# EAGLE schematic MCDB (EAGLE 9.4.2)

## Sheet 1 of 4
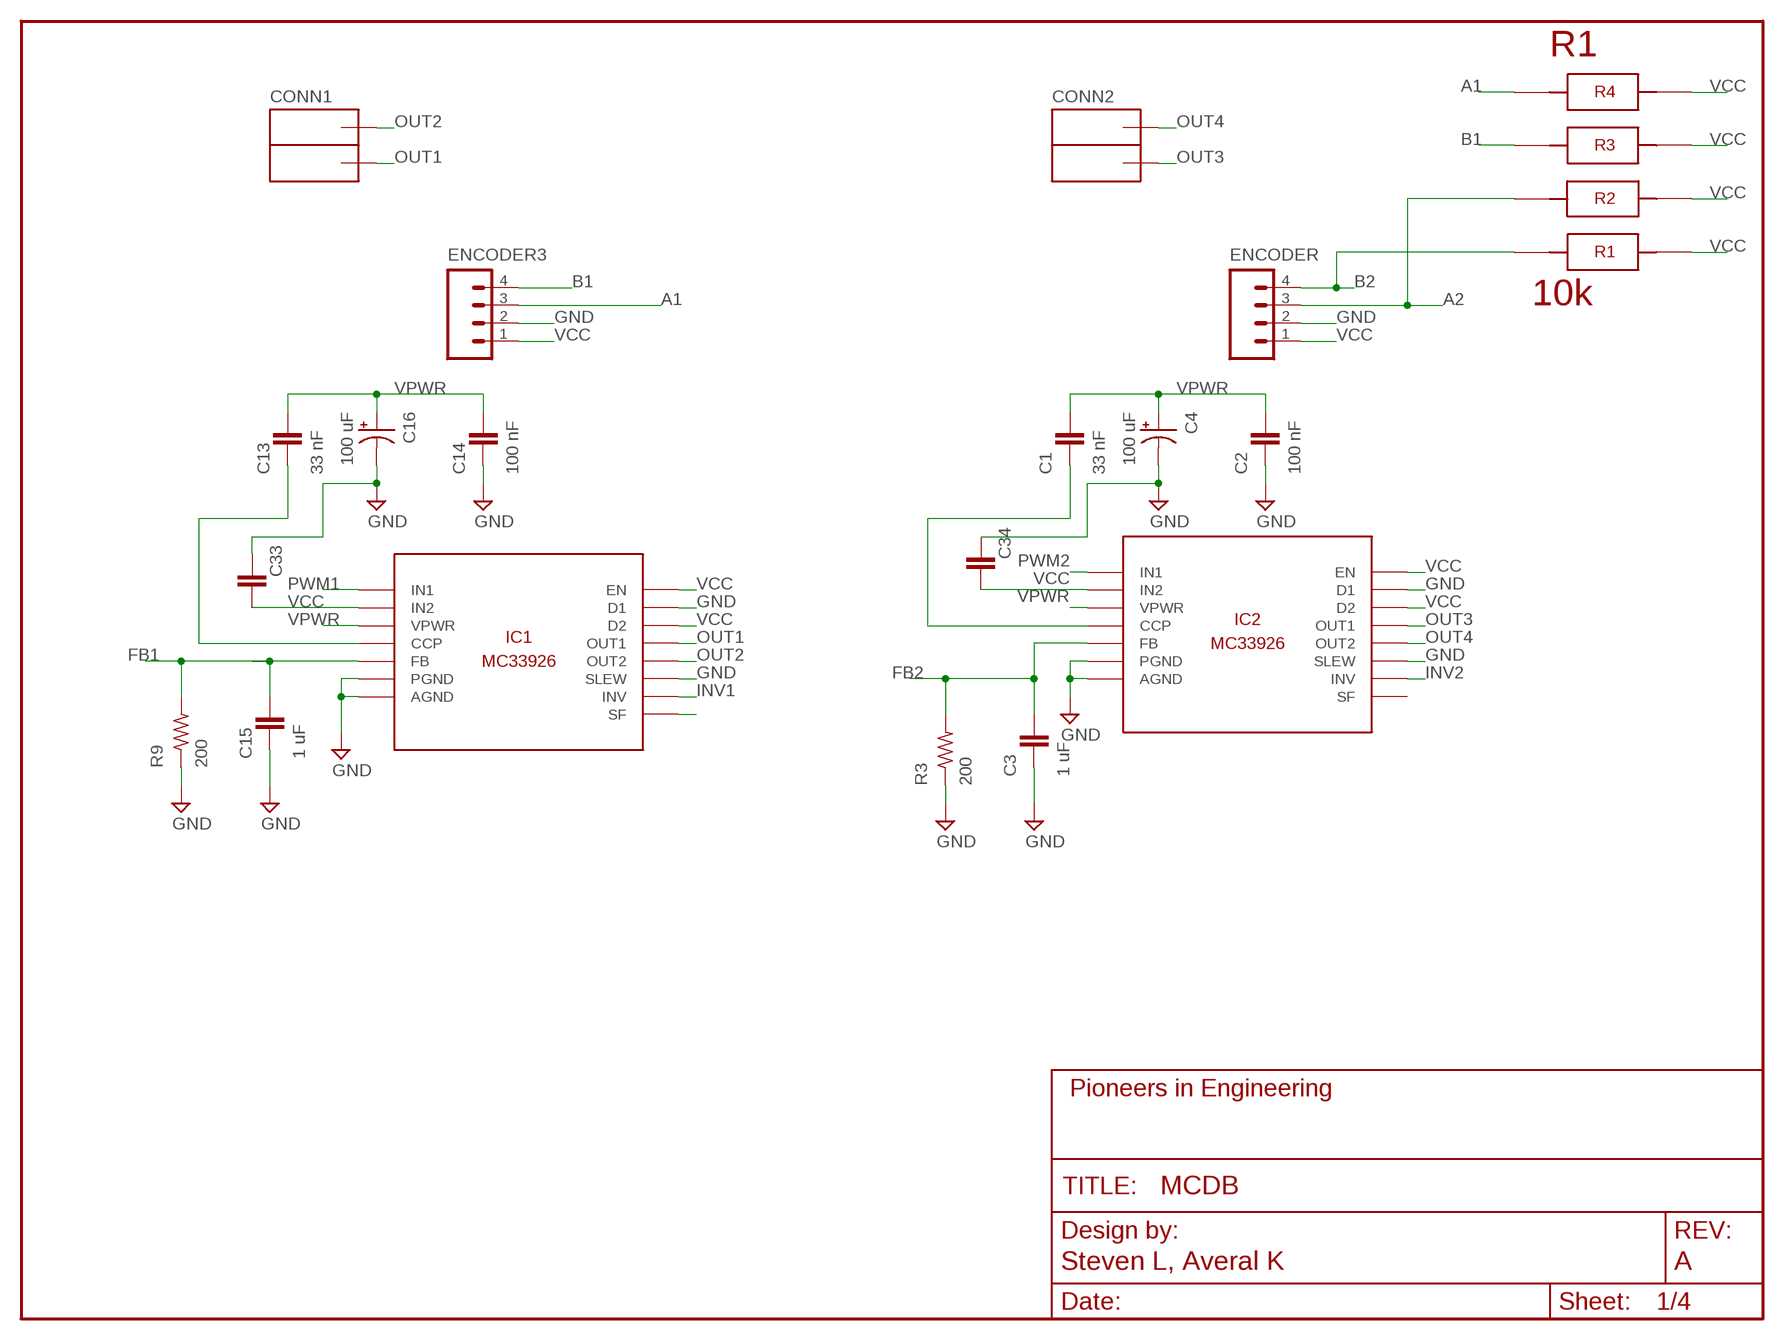
[diagram p0: schematic, sheet 1]
FRAME1 (FRAME_SCHEMATIC): AUTHOR: Steven L, Averal K; REVISION: A

### Parts
C1  33 nF  CAP0603-CAP  [0603-CAP]
C2  100 nF  CAP0603-CAP  [0603-CAP]
C3  1 uF  CAP0603-CAP  [0603-CAP]
C4  100 uF  CAP_POLRADIAL  [.248"CAP_THRU]
C13  33 nF  CAP0603-CAP  [0603-CAP]
C14  100 nF  CAP0603-CAP  [0603-CAP]
C15  1 uF  CAP0603-CAP  [0603-CAP]
C16  100 uF  CAP_POLRADIAL  [.248"CAP_THRU]
C33  CAP0603-CAP  [0603-CAP]
C34  CAP0603-CAP  [0603-CAP]
CONN1  ANDERSONVERTICAL  [ANDERSON_VERTICAL]
CONN2  ANDERSONVERTICAL  [ANDERSON_VERTICAL]
ENCODER  M041X04-MTA  [1X04-MTA]
ENCODER3  M041X04-MTA  [1X04-MTA]
IC1  MC33926  [PQFN-32]
IC2  MC33926  [PQFN-32]
R1  10k  4X-0603  [4X-0603]
R3  200  R-US_R0603  [R0603]
R9  200  R-US_R0603  [R0603]

### Nets
A1: ENCODER3.3 R1.5 ; also sheet 4
A2: ENCODER.3 R1.7 ; also sheet 4
B1: ENCODER3.4 R1.6 ; also sheet 4
B2: ENCODER.4 R1.8 ; also sheet 4
CCP: C13.1 IC1.32(CCP)
CCP2: C1.1 IC2.32(CCP)
FB1: C15.2 IC1.8(FB) R9.2
FB2: C3.2 IC2.8(FB) R3.2
GND: C2.1 C3.1 C4.MINUS(-) C14.1 C15.1 C16.MINUS(-) C33.1 C34.1 ENCODER3.2 ENCODER.2 IC1.3(SLEW) IC1.5(AGND) IC1.18(PGND) IC1.19(PGND) IC1.20(PGND) IC1.22(PGND) IC1.23(PGND) IC1.24(PGND) IC1.26(D1) IC1.MID(AGND) IC2.3(SLEW) IC2.5(AGND) IC2.18(PGND) IC2.19(PGND) IC2.20(PGND) IC2.22(PGND) IC2.23(PGND) IC2.24(PGND) IC2.26(D1) IC2.MID(AGND) R3.1 R9.1 ; also sheet 2,3,4
INV1: IC1.7(INV) ; also sheet 4
INV2: IC2.7(INV) ; also sheet 4
N$11: IC1.21(SF)
OUT1: CONN1.PIN1(OUTB) IC1.12(OUT1) IC1.13(OUT1) IC1.14(OUT1) IC1.15(OUT1)
OUT2: CONN1.PIN2(OUTA) IC1.27(OUT2) IC1.28(OUT2) IC1.29(OUT2) IC1.30(OUT2)
OUT3: CONN2.PIN1(OUTB) IC2.12(OUT1) IC2.13(OUT1) IC2.14(OUT1) IC2.15(OUT1)
OUT4: CONN2.PIN2(OUTA) IC2.27(OUT2) IC2.28(OUT2) IC2.29(OUT2) IC2.30(OUT2)
PWM1: IC1.2(IN1) ; also sheet 4
PWM2: IC2.2(IN1) ; also sheet 4
VCC: C33.2 C34.2 ENCODER3.1 ENCODER.1 IC1.1(IN2) IC1.10(EN) IC1.16(D2) IC2.1(IN2) IC2.10(EN) IC2.16(D2) R1.1 R1.2 R1.3 R1.4 ; also sheet 2,3,4
VPWR: C1.2 C2.2 C4.PLUS(+) C13.2 C14.2 C16.PLUS(+) IC1.4(VPWR) IC1.6(VPWR) IC1.11(VPWR) IC1.31(VPWR) IC2.4(VPWR) IC2.6(VPWR) IC2.11(VPWR) IC2.31(VPWR) ; also sheet 2,3,4
Unconnected: IC2.21(SF)

## Sheet 2 of 4
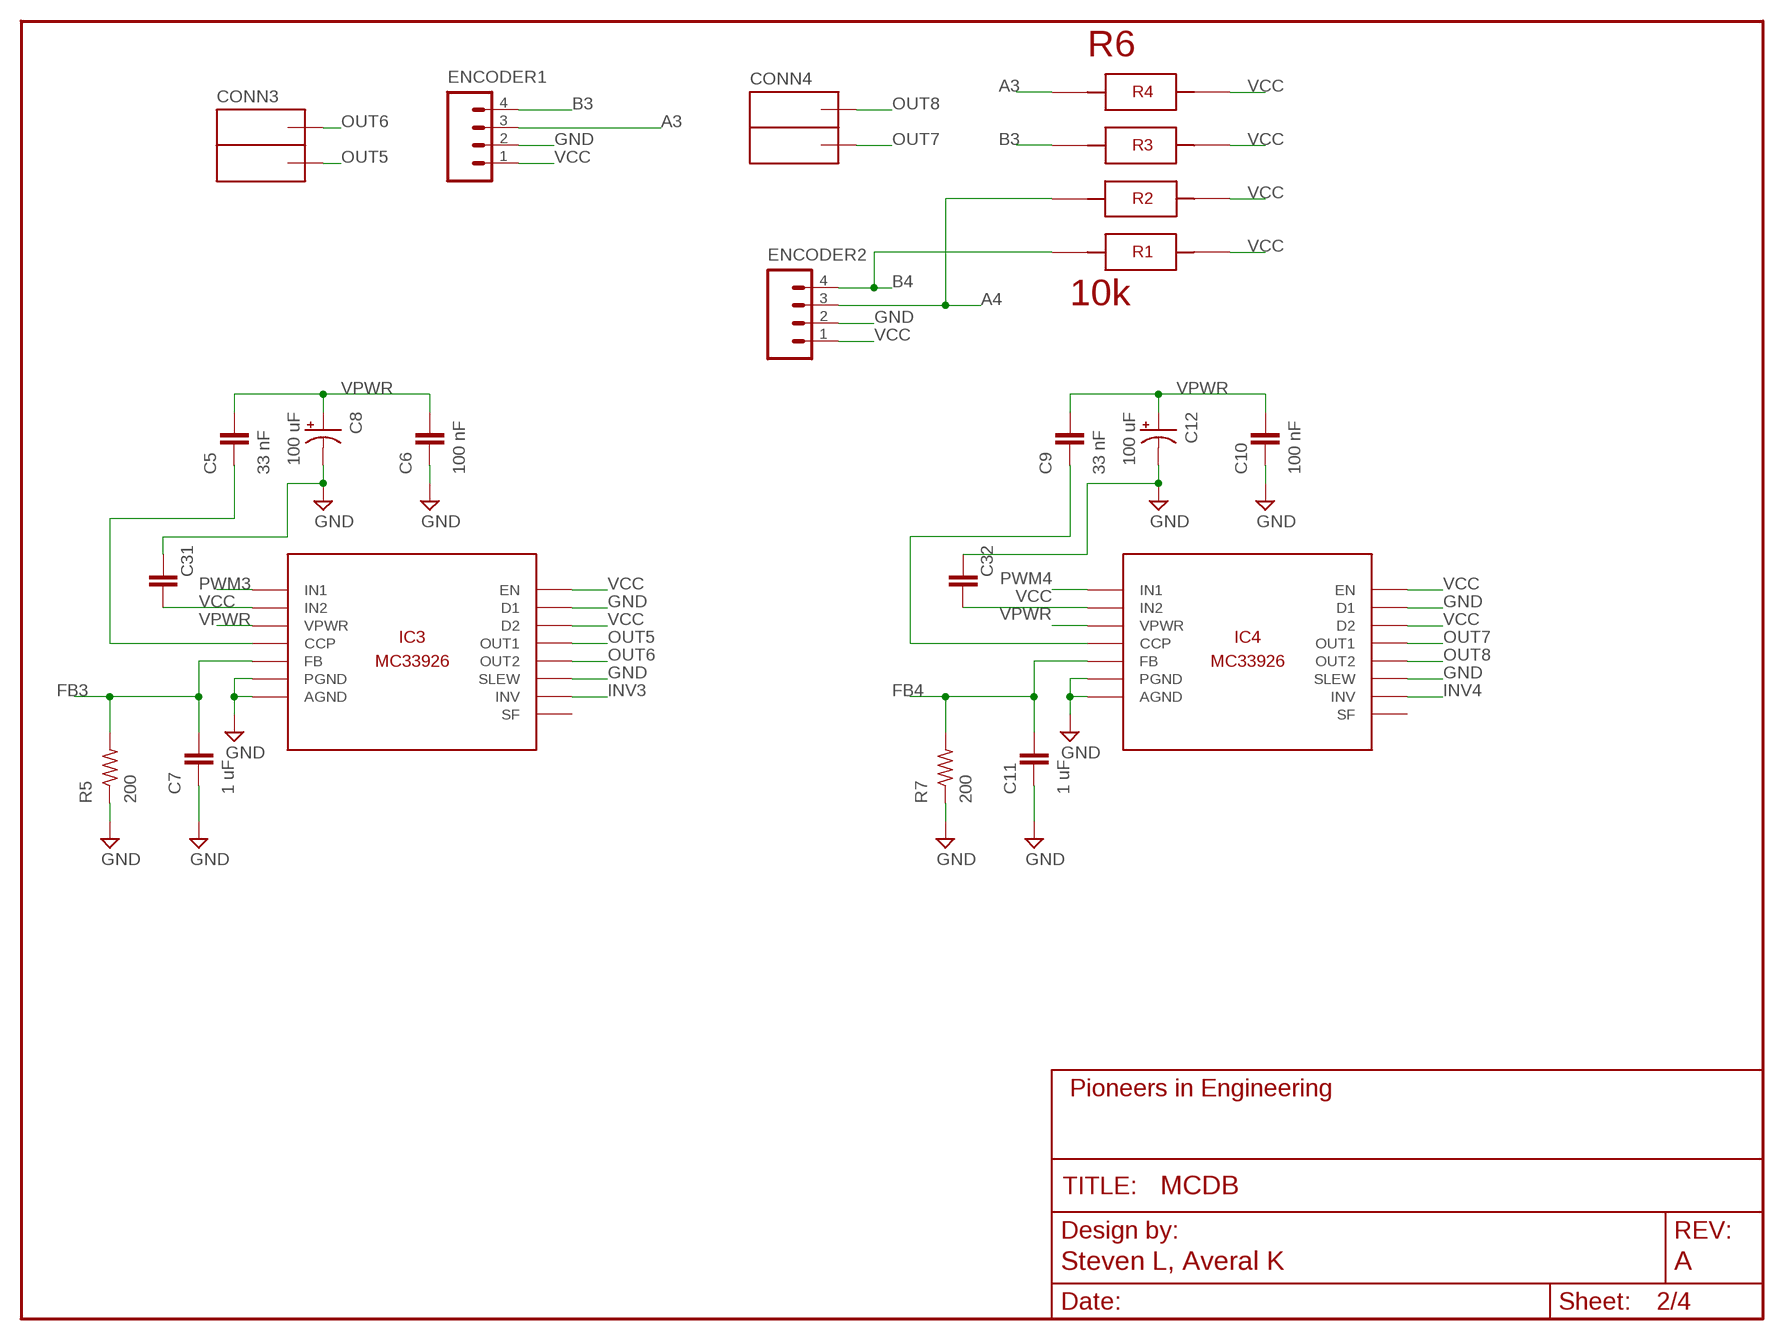
[diagram p1: schematic, sheet 2]
FRAME2 (FRAME_SCHEMATIC): AUTHOR: Steven L, Averal K; REVISION: A

### Parts
C5  33 nF  CAP0603-CAP  [0603-CAP]
C6  100 nF  CAP0603-CAP  [0603-CAP]
C7  1 uF  CAP0603-CAP  [0603-CAP]
C8  100 uF  CAP_POLRADIAL  [.248"CAP_THRU]
C9  33 nF  CAP0603-CAP  [0603-CAP]
C10  100 nF  CAP0603-CAP  [0603-CAP]
C11  1 uF  CAP0603-CAP  [0603-CAP]
C12  100 uF  CAP_POLRADIAL  [.248"CAP_THRU]
C31  CAP0603-CAP  [0603-CAP]
C32  CAP0603-CAP  [0603-CAP]
CONN3  ANDERSONVERTICAL  [ANDERSON_VERTICAL]
CONN4  ANDERSONVERTICAL  [ANDERSON_VERTICAL]
ENCODER1  M041X04-MTA  [1X04-MTA]
ENCODER2  M041X04-MTA  [1X04-MTA]
IC3  MC33926  [PQFN-32]
IC4  MC33926  [PQFN-32]
R5  200  R-US_R0603  [R0603]
R6  10k  4X-0603  [4X-0603]
R7  200  R-US_R0603  [R0603]

### Nets
A3: ENCODER1.3 R6.5 ; also sheet 4
A4: ENCODER2.3 R6.7 ; also sheet 4
B3: ENCODER1.4 R6.6 ; also sheet 4
B4: ENCODER2.4 R6.8 ; also sheet 4
CCP3: C5.1 IC3.32(CCP)
CCP4: C9.1 IC4.32(CCP)
FB3: C7.2 IC3.8(FB) R5.2
FB4: C11.2 IC4.8(FB) R7.2
GND: C6.1 C7.1 C8.MINUS(-) C10.1 C11.1 C12.MINUS(-) C31.1 C32.1 ENCODER1.2 ENCODER2.2 IC3.3(SLEW) IC3.5(AGND) IC3.18(PGND) IC3.19(PGND) IC3.20(PGND) IC3.22(PGND) IC3.23(PGND) IC3.24(PGND) IC3.26(D1) IC3.MID(AGND) IC4.3(SLEW) IC4.5(AGND) IC4.18(PGND) IC4.19(PGND) IC4.20(PGND) IC4.22(PGND) IC4.23(PGND) IC4.24(PGND) IC4.26(D1) IC4.MID(AGND) R5.1 R7.1 ; also sheet 1,3,4
INV3: IC3.7(INV) ; also sheet 4
INV4: IC4.7(INV) ; also sheet 4
OUT5: CONN3.PIN1(OUTB) IC3.12(OUT1) IC3.13(OUT1) IC3.14(OUT1) IC3.15(OUT1)
OUT6: CONN3.PIN2(OUTA) IC3.27(OUT2) IC3.28(OUT2) IC3.29(OUT2) IC3.30(OUT2)
OUT7: CONN4.PIN1(OUTB) IC4.12(OUT1) IC4.13(OUT1) IC4.14(OUT1) IC4.15(OUT1)
OUT8: CONN4.PIN2(OUTA) IC4.27(OUT2) IC4.28(OUT2) IC4.29(OUT2) IC4.30(OUT2)
PWM3: IC3.2(IN1) ; also sheet 4
PWM4: IC4.2(IN1) ; also sheet 4
VCC: C31.2 C32.2 ENCODER1.1 ENCODER2.1 IC3.1(IN2) IC3.10(EN) IC3.16(D2) IC4.1(IN2) IC4.10(EN) IC4.16(D2) R6.1 R6.2 R6.3 R6.4 ; also sheet 1,3,4
VPWR: C5.2 C6.2 C8.PLUS(+) C9.2 C10.2 C12.PLUS(+) IC3.4(VPWR) IC3.6(VPWR) IC3.11(VPWR) IC3.31(VPWR) IC4.4(VPWR) IC4.6(VPWR) IC4.11(VPWR) IC4.31(VPWR) ; also sheet 1,3,4
Unconnected: IC3.21(SF) IC4.21(SF)

## Sheet 3 of 4
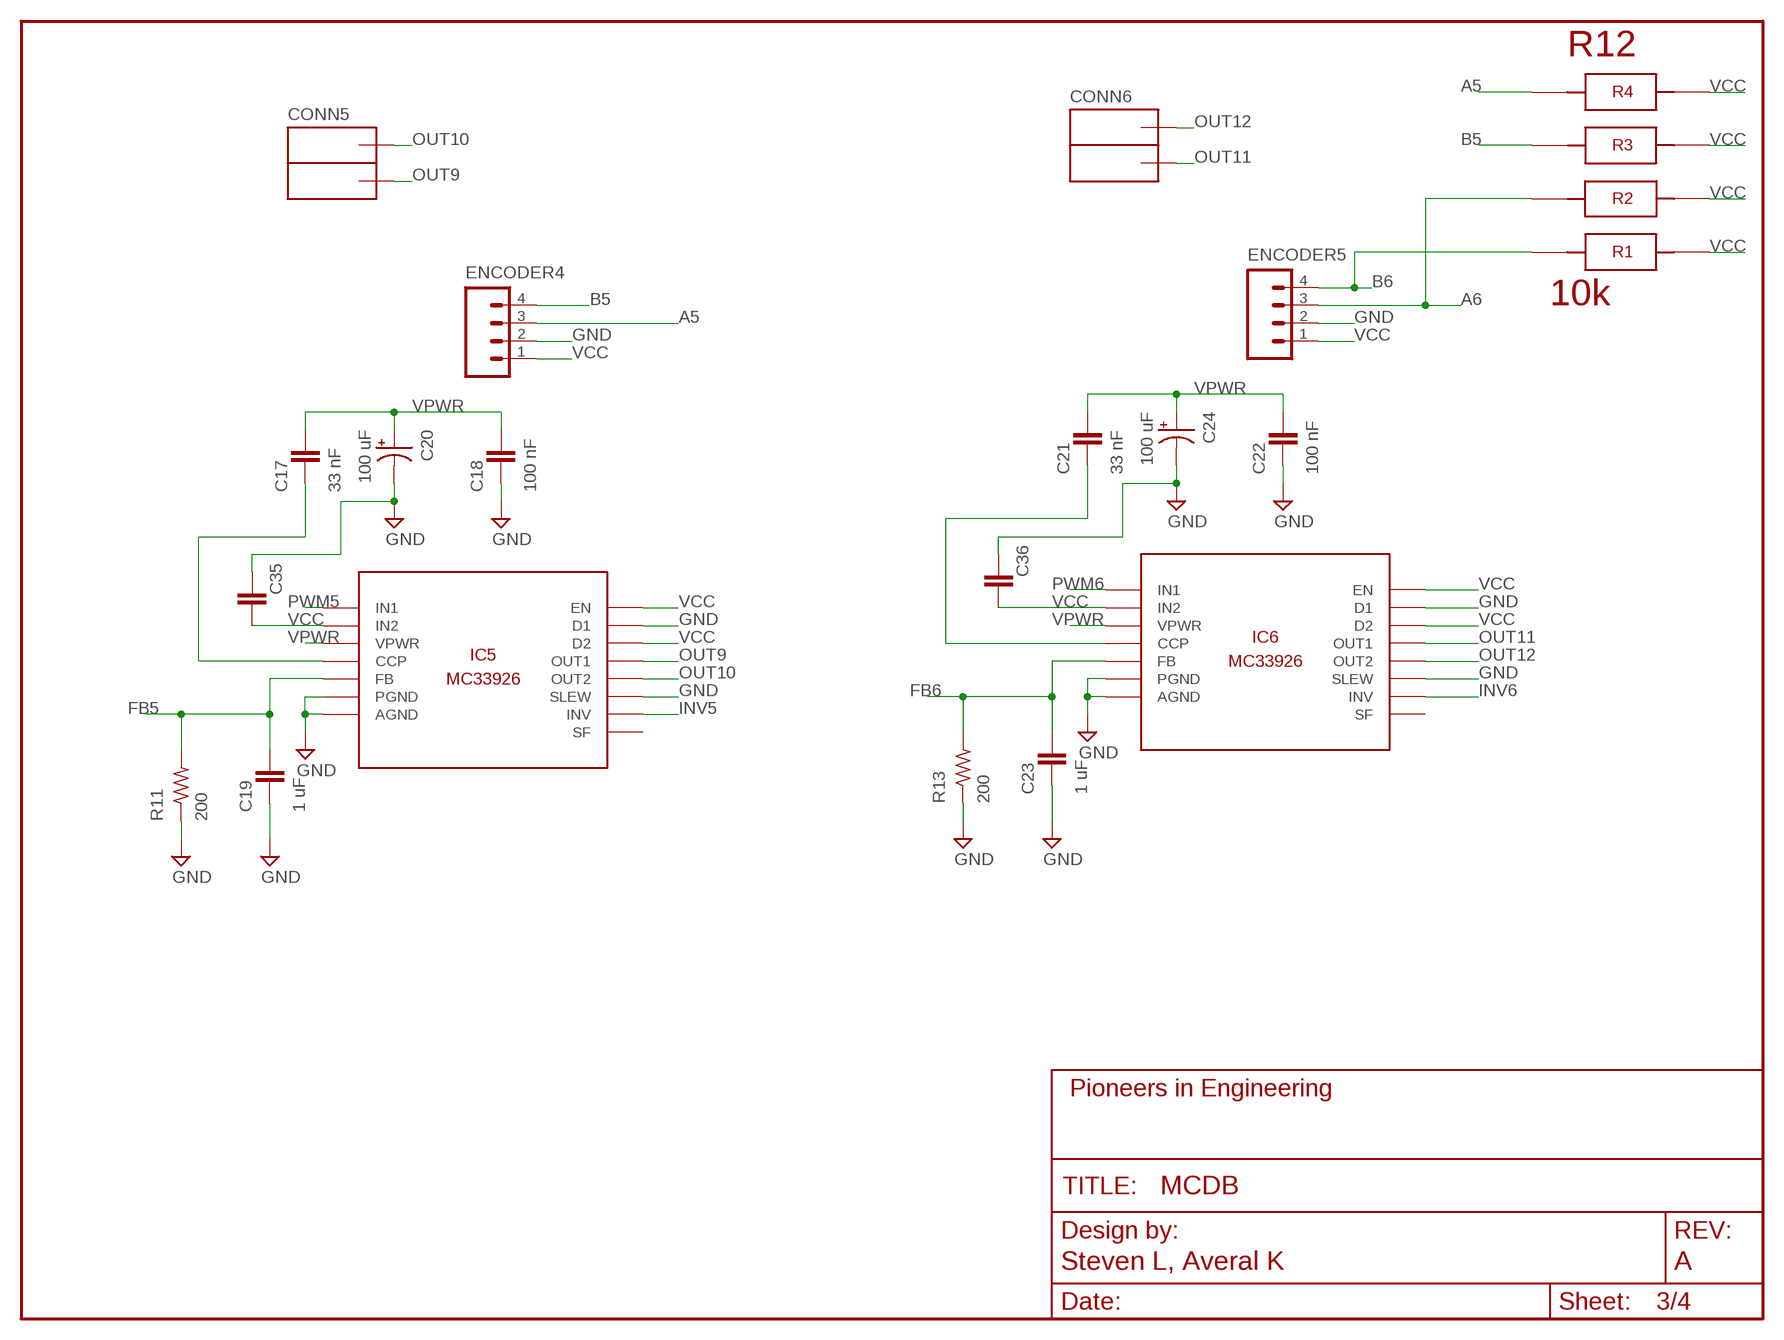
[diagram p2: schematic, sheet 3]
FRAME3 (FRAME_SCHEMATIC): AUTHOR: Steven L, Averal K; REVISION: A

### Parts
C17  33 nF  CAP0603-CAP  [0603-CAP]
C18  100 nF  CAP0603-CAP  [0603-CAP]
C19  1 uF  CAP0603-CAP  [0603-CAP]
C20  100 uF  CAP_POLRADIAL  [.248"CAP_THRU]
C21  33 nF  CAP0603-CAP  [0603-CAP]
C22  100 nF  CAP0603-CAP  [0603-CAP]
C23  1 uF  CAP0603-CAP  [0603-CAP]
C24  100 uF  CAP_POLRADIAL  [.248"CAP_THRU]
C35  CAP0603-CAP  [0603-CAP]
C36  CAP0603-CAP  [0603-CAP]
CONN5  ANDERSONVERTICAL  [ANDERSON_VERTICAL]
CONN6  ANDERSONVERTICAL  [ANDERSON_VERTICAL]
ENCODER4  M041X04-MTA  [1X04-MTA]
ENCODER5  M041X04-MTA  [1X04-MTA]
IC5  MC33926  [PQFN-32]
IC6  MC33926  [PQFN-32]
R11  200  R-US_R0603  [R0603]
R12  10k  4X-0603  [4X-0603]
R13  200  R-US_R0603  [R0603]

### Nets
A5: ENCODER4.3 R12.5 ; also sheet 4
A6: ENCODER5.3 R12.7 ; also sheet 4
B5: ENCODER4.4 R12.6 ; also sheet 4
B6: ENCODER5.4 R12.8 ; also sheet 4
CCP5: C17.1 IC5.32(CCP)
CCP6: C21.1 IC6.32(CCP)
FB5: C19.2 IC5.8(FB) R11.2
FB6: C23.2 IC6.8(FB) R13.2
GND: C18.1 C19.1 C20.MINUS(-) C22.1 C23.1 C24.MINUS(-) C35.1 C36.1 ENCODER4.2 ENCODER5.2 IC5.3(SLEW) IC5.5(AGND) IC5.18(PGND) IC5.19(PGND) IC5.20(PGND) IC5.22(PGND) IC5.23(PGND) IC5.24(PGND) IC5.26(D1) IC5.MID(AGND) IC6.3(SLEW) IC6.5(AGND) IC6.18(PGND) IC6.19(PGND) IC6.20(PGND) IC6.22(PGND) IC6.23(PGND) IC6.24(PGND) IC6.26(D1) IC6.MID(AGND) R11.1 R13.1 ; also sheet 1,2,4
INV5: IC5.7(INV) ; also sheet 4
INV6: IC6.7(INV) ; also sheet 4
OUT9: CONN5.PIN1(OUTB) IC5.12(OUT1) IC5.13(OUT1) IC5.14(OUT1) IC5.15(OUT1)
OUT10: CONN5.PIN2(OUTA) IC5.27(OUT2) IC5.28(OUT2) IC5.29(OUT2) IC5.30(OUT2)
OUT11: CONN6.PIN1(OUTB) IC6.12(OUT1) IC6.13(OUT1) IC6.14(OUT1) IC6.15(OUT1)
OUT12: CONN6.PIN2(OUTA) IC6.27(OUT2) IC6.28(OUT2) IC6.29(OUT2) IC6.30(OUT2)
PWM5: IC5.2(IN1) ; also sheet 4
PWM6: IC6.2(IN1) ; also sheet 4
VCC: C35.2 C36.2 ENCODER4.1 ENCODER5.1 IC5.1(IN2) IC5.10(EN) IC5.16(D2) IC6.1(IN2) IC6.10(EN) IC6.16(D2) R12.1 R12.2 R12.3 R12.4 ; also sheet 1,2,4
VPWR: C17.2 C18.2 C20.PLUS(+) C21.2 C22.2 C24.PLUS(+) IC5.4(VPWR) IC5.6(VPWR) IC5.11(VPWR) IC5.31(VPWR) IC6.4(VPWR) IC6.6(VPWR) IC6.11(VPWR) IC6.31(VPWR) ; also sheet 1,2,4
Unconnected: IC5.21(SF) IC6.21(SF)

## Sheet 4 of 4
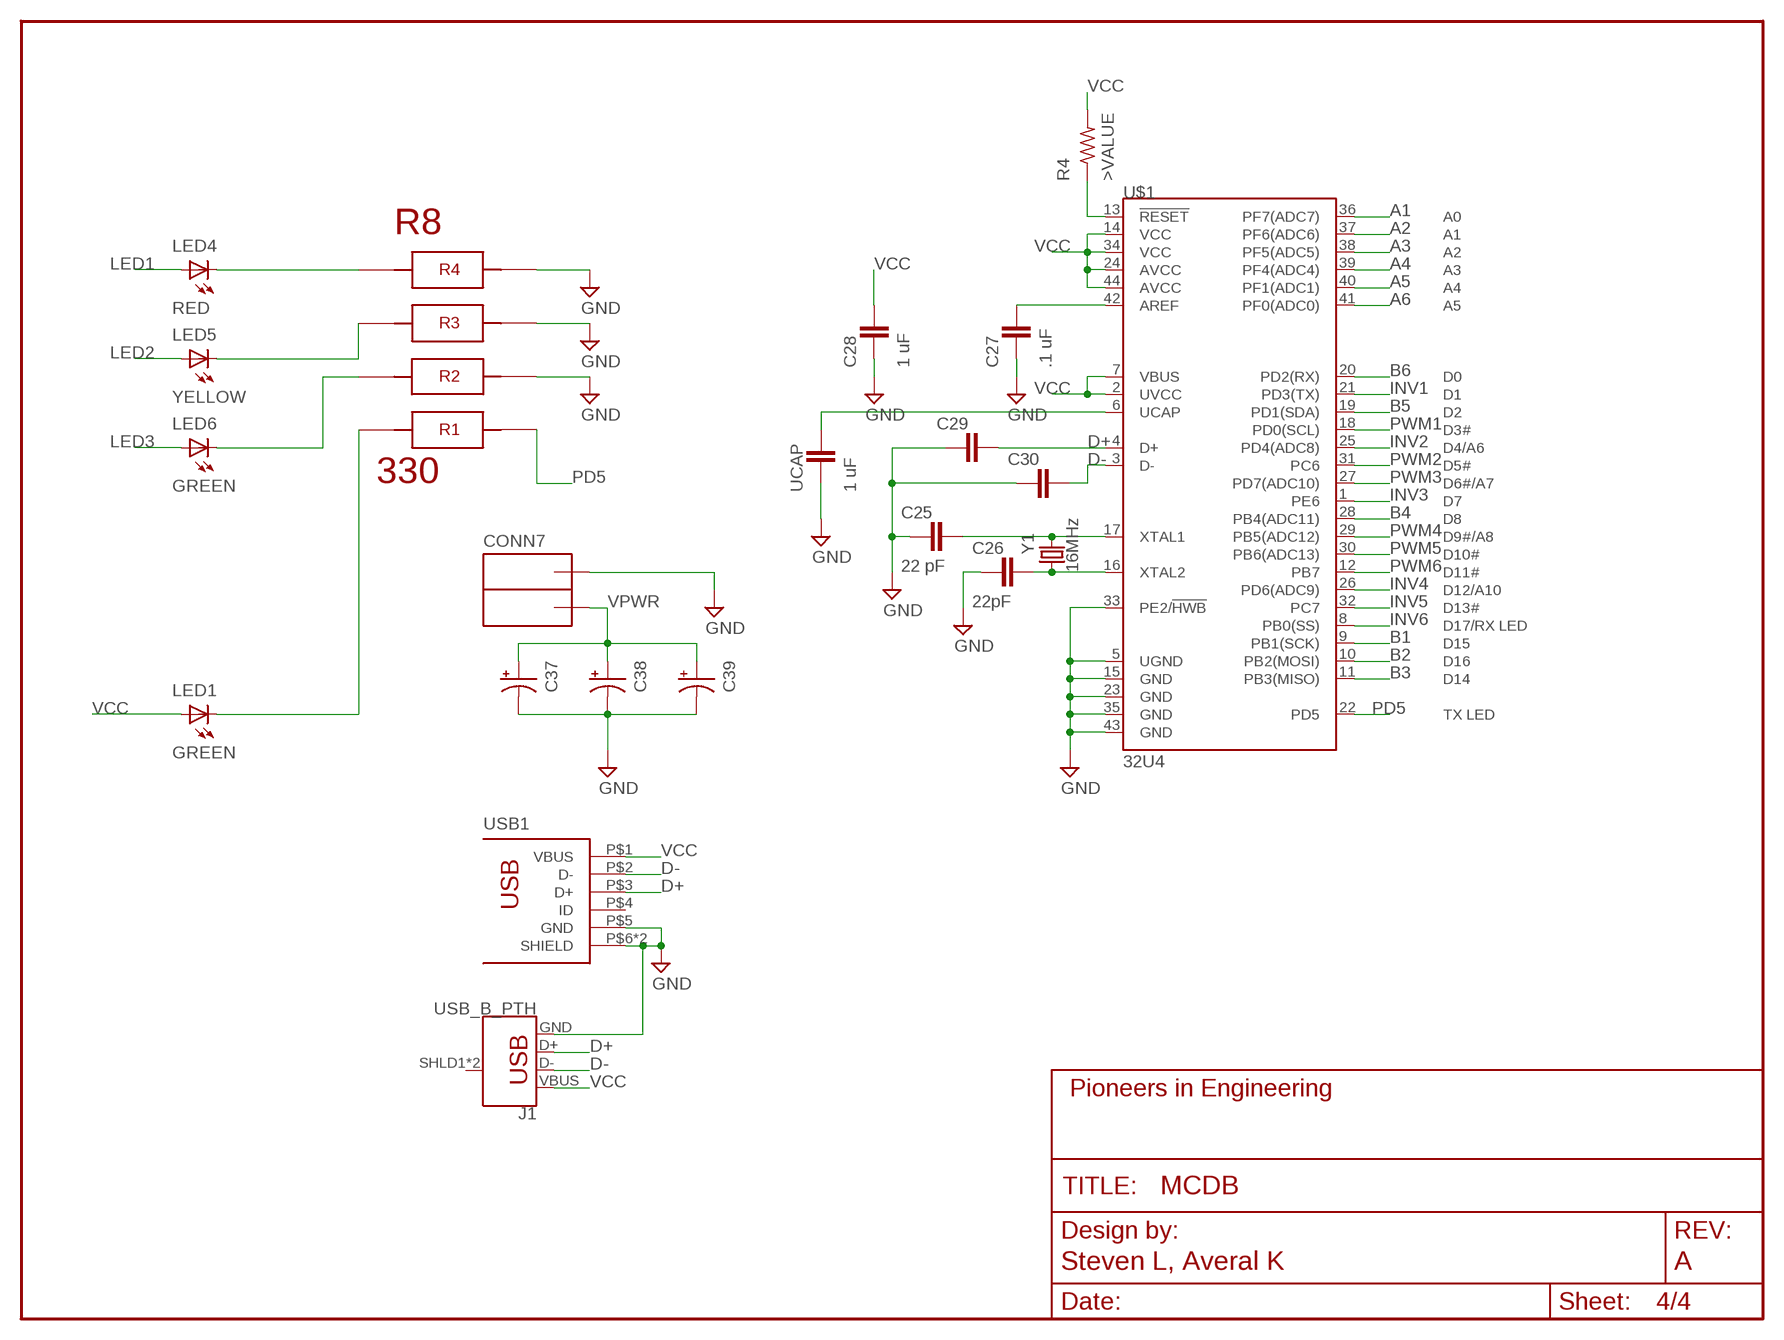
[diagram p3: schematic, sheet 4]
FRAME4 (FRAME_SCHEMATIC): AUTHOR: Steven L, Averal K; REVISION: A

### Parts
C25  22 pF  CAP0603-CAP  [0603-CAP]
C26  22pF  CAP0603-CAP  [0603-CAP]
C27  .1 uF  CAP0603-CAP  [0603-CAP]
C28  1 uF  CAP0603-CAP  [0603-CAP]
C29  CAP0603-CAP  [0603-CAP]
C30  CAP0603-CAP  [0603-CAP]
C37  CAP_POLRADIAL  [.248"CAP_THRU]
C38  CAP_POLRADIAL  [.248"CAP_THRU]
C39  CAP_POLRADIAL  [.248"CAP_THRU]
CONN7  ANDERSONVERTICAL  [ANDERSON_VERTICAL]
J1  USB_B_PTH  [USB-B-PTH]
LED1  GREEN  LED1206  [LED-1206]
LED4  RED  LED1206  [LED-1206]
LED5  YELLOW  LED1206  [LED-1206]
LED6  GREEN  LED1206  [LED-1206]
R4  >VALUE  R-US_R0603  [R0603]
R8  330  4X-0603  [4X-0603]
U$1  32U4  ATMEGA32U4TQFP-44  [TQFP44]
UCAP  1 uF  CAP0603-CAP  [0603-CAP]
USB1  USB-OTGMICRO-AB-VERT  [USB-MICRO-AB-VERT]
Y1  16MHz  CRYSTAL7.6X4.1  [CRYSTAL-SMD-7.6X4.1-2PIN]

### Nets
A1: U$1.36(PF7(ADC7)) ; also sheet 1
A2: U$1.37(PF6(ADC6)) ; also sheet 1
A3: U$1.38(PF5(ADC5)) ; also sheet 2
A4: U$1.39(PF4(ADC4)) ; also sheet 2
A5: U$1.40(PF1(ADC1)) ; also sheet 3
A6: U$1.41(PF0(ADC0)) ; also sheet 3
B1: U$1.9(PB1(SCK)) ; also sheet 1
B2: U$1.10(PB2(MOSI)) ; also sheet 1
B3: U$1.11(PB3(MISO)) ; also sheet 2
B4: U$1.28(PB4(ADC11)) ; also sheet 2
B5: U$1.19(PD1(SDA)) ; also sheet 3
B6: U$1.20(PD2(RX)) ; also sheet 3
D+: C29.2 J1.D+ U$1.4(D+) USB1.P$3(D+)
D-: C30.2 J1.D- U$1.3(D-) USB1.P$2(D-)
GND: C25.1 C26.1 C27.1 C28.1 C29.1 C30.1 C37.MINUS(-) C38.MINUS(-) C39.MINUS(-) CONN7.PIN2(OUTA) J1.GND R8.2 R8.3 R8.4 U$1.5(UGND) U$1.15(GND) U$1.23(GND) U$1.33(PE2/!HWB) U$1.35(GND) U$1.43(GND) UCAP.1 USB1.P$5(GND) USB1.P$6(SHIELD) USB1.P$7(SHIELD) ; also sheet 1,2,3
INV1: U$1.21(PD3(TX)) ; also sheet 1
INV2: U$1.25(PD4(ADC8)) ; also sheet 1
INV3: U$1.1(PE6) ; also sheet 2
INV4: U$1.26(PD6(ADC9)) ; also sheet 2
INV5: U$1.32(PC7) ; also sheet 3
INV6: U$1.8(PB0(SS)) ; also sheet 3
LED1: LED4.A
LED2: LED5.A
LED3: LED6.A
N$4: LED4.C R8.5
N$5: LED6.C R8.7
N$7: LED5.C R8.6
N$12: LED1.C R8.8
N$16: U$1.6(UCAP) UCAP.2
N$17: C25.2 U$1.17(XTAL1) Y1.P$2
N$18: C26.2 U$1.16(XTAL2) Y1.P$1
N$19: C27.2 U$1.42(AREF)
N$21: R4.1 U$1.13(!RESET)
PD5: R8.1 U$1.22(PD5)
PWM1: U$1.18(PD0(SCL)) ; also sheet 1
PWM2: U$1.31(PC6) ; also sheet 1
PWM3: U$1.27(PD7(ADC10)) ; also sheet 2
PWM4: U$1.29(PB5(ADC12)) ; also sheet 2
PWM5: U$1.30(PB6(ADC13)) ; also sheet 3
PWM6: U$1.12(PB7) ; also sheet 3
VCC: C28.2 J1.VBUS LED1.A R4.2 U$1.2(UVCC) U$1.7(VBUS) U$1.14(VCC) U$1.24(AVCC) U$1.34(VCC) U$1.44(AVCC) USB1.P$1(VBUS) ; also sheet 1,2,3
VPWR: C37.PLUS(+) C38.PLUS(+) C39.PLUS(+) CONN7.PIN1(OUTB) ; also sheet 1,2,3
Unconnected: J1.SHLD1(SHIELD) J1.SHLD2(SHIELD) USB1.P$4(ID)

## Library data of the parts
C1-C3 C5-C7 C9-C11 C13-C15 C17-C19 C21-C23 C25-C36 UCAP = pie:CAP: Capacitor Standard 0603 ceramic capacitor, and 0.1" leaded capacitor.; PIE-INT-REF-NUM: CAPACITOR-GENERIC
C4 C8 C12 C16 C20 C24 C37-C39 = pie:CAP_POL: Capacitor Polarized These are standard SMD and PTH capacitors. Normally 10uF, 47uF, and 100uF in electrolytic and tantalum varieties. Always verify the external diameter of the through hole cap, it varies with capacity, voltage, and manufacturer. The EIA devices should be standard.
CONN1-CONN7 = pie:ANDERSON: 2-pin 25A Anderson Connector http://www.alliedelec.com/images/products/datasheets/bm/ANDERSON_POWER_PRODUCTS/70162018.pdf; PIE-INT-REF-NUM: Anderson
ENCODER ENCODER1-ENCODER5 = pie:M04: 4-pin 0.1-inch header and MTA connector; PIE-INT-REF-NUM: MTA
IC1-IC6 = pie:MC33926
J1 = SparkFun-Connectors:USB_B: USB Type B Connector SparkFun Products: SparkFun Stepoko <https://www.sparkfun.com/products/13899> PTH; PROD_ID: CONN-08278; SF_ID: PRT-00139
LED1 LED4-LED6 = pie:LED: LEDs Standard schematic elements and footprints for 5mm, 3mm, 1206, and 0603 sized LEDs. 5mm - Spark Fun Electronics SKU : COM-00529 (and others); PIE-INT-REF-NUM: LED
R1 R6 R8 R12 = pie:4X-0603: 330: https://www.digikey.com/product-detail/en/panasonic-electronic-components/EXB-38V331JV/Y9331CT-ND/256586 10k: https://www.digikey.com/product-detail/en/panasonic-electronic-components/EXB-38V103JV/Y9103CT-ND/256604
R3 R5 R7 R9 R11 R13 = pie:R-US_: RESISTOR, American symbol; DESCRIPTION: RESISTOR, American symbol; DISTRIBUTOR: DigiKey; MANUFACTURER: Rohm Semiconductor; NOTES: Cut Tape; PACKAGE: R0603; VALUE: >VALUE
R4 = pie:R-US_: RESISTOR, American symbol; DESCRIPTION: RESISTOR, American symbol; DISTRIBUTOR: DigiKey; MANUFACTURER: Rohm Semiconductor; NOTES: Cut Tape; PACKAGE: R0603
U$1 = pie:ATMEGA32U4: Atmel MCU, 32KByte Atmel 44-pin 8-bit Microcontroller with 32KBytes of ISP Flash and USB Controller Datasheet <http://cdn.sparkfun.com/datasheets/Dev/Arduino/Boards/ATMega32U4.pdf> SparkFun Products LilyPad Arduino USB - ATmega32U4 Board <https://www.sparkfun.com/products/12049> (DEV-12049) Pro Micro - 5V/16MHz <https://www.sparkfun.com/products/12640> (DEV-12640) Pro Micro - 3.3V/8MHz <https://www.sparkfun.com/products/12587> (DEV-12587) Fio v3 - ATmega32U4 <https://www.sparkfun.com/products/11520> (DEV-11520) Qduino Mini <https://www.sparkfun.com/products/13614> (DEV-13614) Makey Makey - Standard Kit <https://www.sparkfun.com/products/11511> (WIG-11511) Makey Makey Deluxe Kit <https://www.sparkfun.com/products/11519> (WIG-11519); PROD_ID: IC-11161
USB1 = pie:USB-OTG: USB Connector OTG connector with ID pin; PIE-DIGIKEY-PN: 732-5959-1-ND
Y1 = pie:CRYSTAL: Various standard crystals. Proven footprints. Spark Fun Electronics SKU : COM-00534